# Altium schematic sheet Stem_Diameter_Measurement.SchDoc
size A4; SheetNumber: 8; SheetTotal: 8
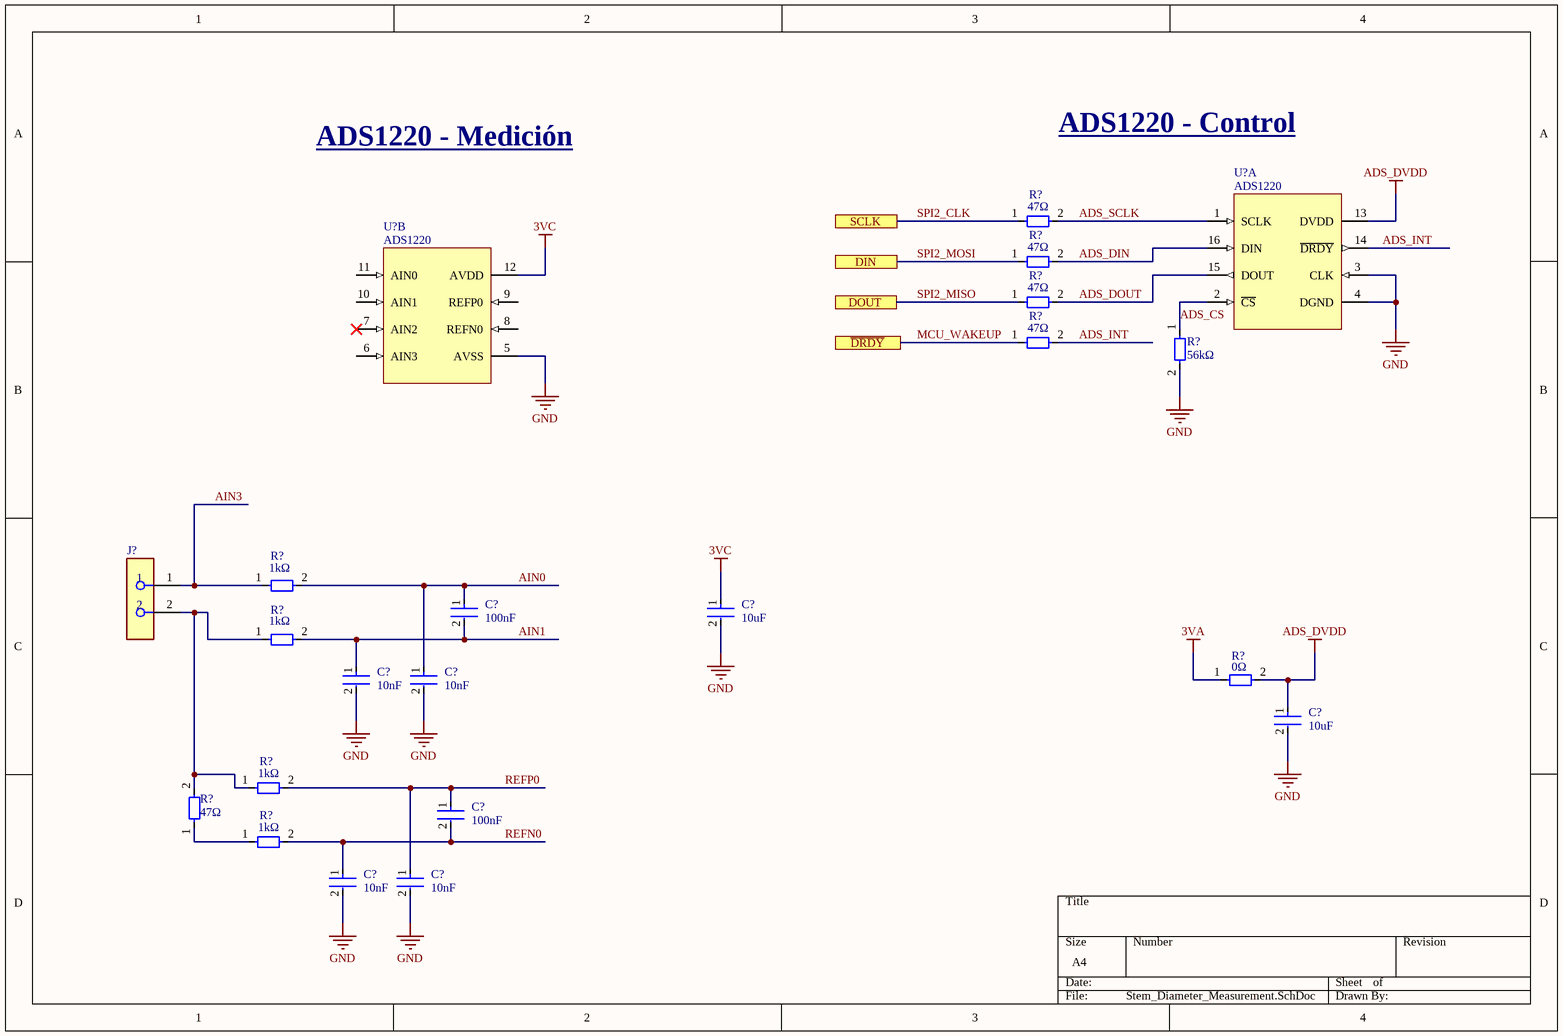
[diagram p0: Stem_Diameter_Measurement.SchDoc]

## Parts
(Parts that share a designator on the sheet are numbered #1, #2 ... from top to bottom, then left to right.)
C?#1  Capacitance: 100nF  [FP-CL21-IPC_B]  (hidden comment: CL21A106KPFNNNE)
C?#2  Capacitance: 10uF  [FP-CL21-IPC_B]  (hidden comment: CL21A106KPFNNNE)
C?#3  Capacitance: 10nF  [FP-CL21-IPC_B]  (hidden comment: CL21A106KPFNNNE)
C?#4  Capacitance: 10nF  [FP-CL21-IPC_B]  (hidden comment: CL21A106KPFNNNE)
C?#5  Capacitance: 10uF  [FP-CL21-IPC_B]  (hidden comment: CL21A106KPFNNNE)
C?#6  Capacitance: 100nF  [FP-CL21-IPC_B]  (hidden comment: CL21A106KPFNNNE)
C?#7  Capacitance: 10nF  [FP-CL21-IPC_B]  (hidden comment: CL21A106KPFNNNE)
C?#8  Capacitance: 10nF  [FP-CL21-IPC_B]  (hidden comment: CL21A106KPFNNNE)
J?  PPTC021LGBN-RC  [FP-PPTC021LGBN-RC-MFG]  (value not drawn)
R?#1  value 47Ω  [PACKAGE_0805]  (hidden comment: Simbolo de resistencia genérica)
R?#2  value 47Ω  [PACKAGE_0805]  (hidden comment: Simbolo de resistencia genérica)
R?#3  value 47Ω  [PACKAGE_0805]  (hidden comment: Simbolo de resistencia genérica)
R?#4  value 47Ω  [PACKAGE_0805]  (hidden comment: Simbolo de resistencia genérica)
R?#5  value 56kΩ  [PACKAGE_0805]  (hidden comment: Simbolo de resistencia genérica)
R?#6  value 1kΩ  [PACKAGE_0805]  (hidden comment: Simbolo de resistencia genérica)
R?#7  value 1kΩ  [PACKAGE_0805]  (hidden comment: Simbolo de resistencia genérica)
R?#8  value 0Ω  [PACKAGE_0805]  (hidden comment: Simbolo de resistencia genérica)
R?#9  value 1kΩ  [PACKAGE_0805]  (hidden comment: Simbolo de resistencia genérica)
R?#10  value 47Ω  [PACKAGE_0805]  (hidden comment: Simbolo de resistencia genérica)
R?#11  value 1kΩ  [PACKAGE_0805]  (hidden comment: Simbolo de resistencia genérica)
U?#1  ADS1220  [TSSOP-16]  (part A of 2)
U?#2  ADS1220  [TSSOP-16]  (part B of 2)

## Ports
DIN, DOUT, SCLK, ~{DRDY}

## Nets
3VA: R?#8.1
3VC: C?#2.1 U?#2.12(AVDD)
ADS_DVDD: C?#5.1 R?#8.2 U?#1.13(DVDD)
GND: C?#2.2 C?#3.2 C?#4.2 C?#5.2 C?#7.2 C?#8.2 R?#5.2 U?#1.3(CLK) U?#1.4(DGND) U?#2.5(AVSS)
ADS_CS: R?#5.1 U?#1.2(~{CS})
ADS_DIN: R?#2.2 U?#1.16(DIN)
ADS_DOUT: R?#3.2 U?#1.15(DOUT)
ADS_INT: R?#4.2 U?#1.14(~{DRDY})
ADS_SCLK: R?#1.2 U?#1.1(SCLK)
AIN0: C?#1.1 C?#4.1 R?#6.2
AIN1: C?#1.2 C?#3.1 R?#7.2
AIN3: J?.1 R?#6.1
MCU_WAKEUP: R?#4.1 ; port ~{DRDY}
REFN0: C?#6.2 C?#7.1 R?#11.2
REFP0: C?#6.1 C?#8.1 R?#9.2
SPI2_CLK: R?#1.1 ; port SCLK
SPI2_MISO: R?#3.1 ; port DOUT
SPI2_MOSI: R?#2.1 ; port DIN
NetJ?_2: J?.2 R?#7.1 R?#9.1 R?#10.2
NetR?#10_1: R?#10.1 R?#11.1

Not connected (* = marked no-connect by the designer): U?#2 6(AIN3) 7(AIN2)* 8(REFN0) 9(REFP0) 10(AIN1) 11(AIN0)

## Notes on the sheet
- ADS1220 - Medición
- ADS1220 - Control

## Library data of the parts
C?#1-C?#8 = CMP-2000-06103-2: CL21 Series 0805 10uF 10V ±10% Tolerance X5R Multilayer Ceramic Chip Capacitor; Case Code (Imperial): 0805; Mount: Surface Mount; Depth: 1.25mm; Length: 2mm; Lead Free: Lead Free; Packaging: Tape and Reel; Dielectric: X5R; Width: 0.049inch; Package Quantity: 1; Height: 1.25mm; Case/Package: 0805; Voltage Rating: 10V; Thickness: 0.053inch; Max Operating Temperature: 85°C; Tolerance: 10%; Case Code (Metric): 2012; Contact Plating: Tin; Min Operating Temperature: -55°C; Radiation Hardening: No; Voltage Rating (DC): 10V
J? = CMP-00595-00270342-1: PPTC021LGBN-RC 2 Position Total Single Row 2.54 mm Pitch Right Angle Female Header; NexarPartId: 270342; Pitch: 2.54mm; Current Rating: 3A; Number of Positions: 2; Voltage Rating: 250V; Connector Type: Header, Socket; Lead Free: Lead Free; Height: 2.4mm; Contact Material: Bronze, Nickel, Tin; Color: Black; RoHS: Compliant; Width: 8.5mm; Min Operating Temperature: -40°C; Housing Color: Black; Max Operating Temperature: 105°C; Termination: Solder; Mount: Through Hole; Packaging: Bulk; Contact Plating: Tin; Number of Rows: 1; Housing Material: Plastic; Length: 5.58mm; Number of Contacts: 2
R?#1-R?#11 = Generic R
U?#1 U?#2 = ADS1220: ADS1220 4-Channel, 2-kSPS, Low-Power, 24-Bit ADC with Integrated PGA and Reference